# Altium schematic sheet Main Board RGB.SchDoc
size B
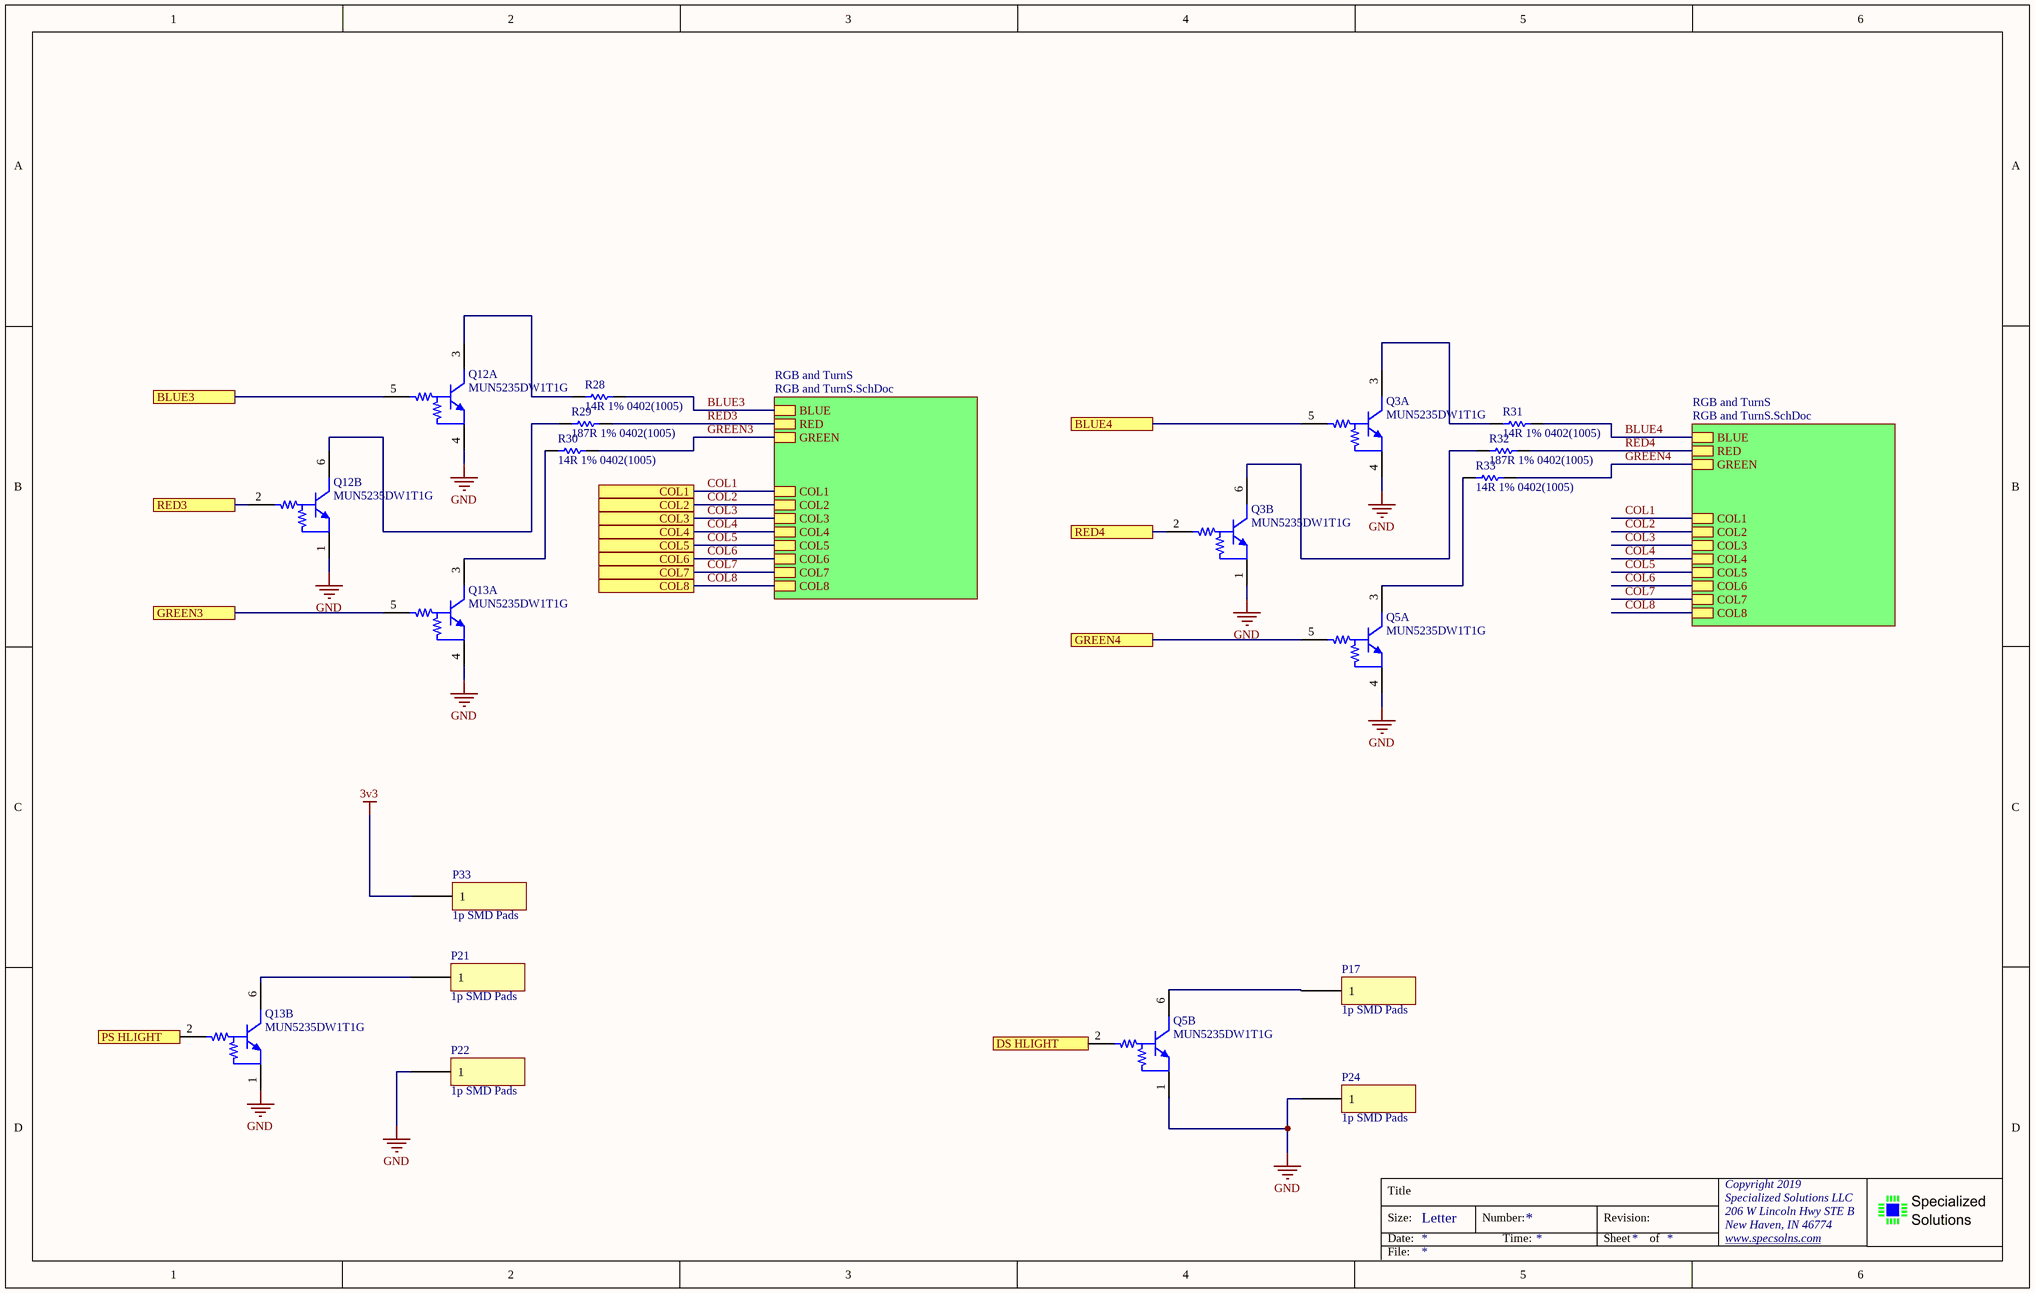
[diagram p0: Main Board RGB.SchDoc]

## Parts
P17  1p SMD Pads  [1p SMD pad]
P21  1p SMD Pads  [1p SMD pad]
P22  1p SMD Pads  [1p SMD pad]
P24  1p SMD Pads  [1p SMD pad]
P33  1p SMD Pads  [1p SMD pad]
Q3  MUN5235DW1T1G  [ONSC-SOT-363-6-419B-02_V]  (parts A,B of 2)
Q5  MUN5235DW1T1G  [ONSC-SOT-363-6-419B-02_V]  (parts A,B of 2)
Q12  MUN5235DW1T1G  [ONSC-SOT-363-6-419B-02_V]  (parts A,B of 2)
Q13  MUN5235DW1T1G  [ONSC-SOT-363-6-419B-02_V]  (parts A,B of 2)
R28  14R 1% 0402(1005)  [RESC0402(1005)_N]
R29  187R 1% 0402(1005)  [RESC0402(1005)_N]
R30  14R 1% 0402(1005)  [RESC0402(1005)_N]
R31  14R 1% 0402(1005)  [RESC0402(1005)_N]
R32  187R 1% 0402(1005)  [RESC0402(1005)_N]
R33  14R 1% 0402(1005)  [RESC0402(1005)_N]

## Sub-sheets
RGB and TurnS = RGB and TurnS.SchDoc: BLUE, RED, GREEN, COL7, COL5, COL3, COL1, COL2, COL4, COL6, COL8
RGB and TurnS = RGB and TurnS.SchDoc: BLUE, RED, GREEN, COL7, COL5, COL3, COL1, COL2, COL4, COL6, COL8

## Ports
BLUE3, BLUE4, COL1, COL2, COL3, COL4, COL5, COL6, COL7, COL8, DS HLIGHT, GREEN3, GREEN4, PS HLIGHT, RED3, RED4

## Nets
3v3: P33.1
GND: P22.1 P24.1 Q3.1(E) Q3.4(E) Q5.1(E) Q5.4(E) Q12.1(E) Q12.4(E) Q13.1(E) Q13.4(E)
BLUE3: R28.2 ; sheet RGB and TurnS/BLUE
BLUE3: Q12.5(B) ; port BLUE3  [a separate net that carries the same name]
BLUE4: R31.2 ; sheet RGB and TurnS/BLUE
BLUE4: Q3.5(B) ; port BLUE4  [a separate net that carries the same name]
COL1: port COL1, sheet RGB and TurnS/COL1, sheet RGB and TurnS/COL1
COL2: port COL2, sheet RGB and TurnS/COL2, sheet RGB and TurnS/COL2
COL3: port COL3, sheet RGB and TurnS/COL3, sheet RGB and TurnS/COL3
COL4: port COL4, sheet RGB and TurnS/COL4, sheet RGB and TurnS/COL4
COL5: port COL5, sheet RGB and TurnS/COL5, sheet RGB and TurnS/COL5
COL6: port COL6, sheet RGB and TurnS/COL6, sheet RGB and TurnS/COL6
COL7: port COL7, sheet RGB and TurnS/COL7, sheet RGB and TurnS/COL7
COL8: port COL8, sheet RGB and TurnS/COL8, sheet RGB and TurnS/COL8
DS HLIGHT: Q5.2(B) ; port DS HLIGHT
GREEN3: R30.2 ; sheet RGB and TurnS/GREEN
GREEN3: Q13.5(B) ; port GREEN3  [a separate net that carries the same name]
GREEN4: R33.2 ; sheet RGB and TurnS/GREEN
GREEN4: Q5.5(B) ; port GREEN4  [a separate net that carries the same name]
PS HLIGHT: Q13.2(B) ; port PS HLIGHT
RED3: R29.2 ; sheet RGB and TurnS/RED
RED3: Q12.2(B) ; port RED3  [a separate net that carries the same name]
RED4: R32.2 ; sheet RGB and TurnS/RED
RED4: Q3.2(B) ; port RED4  [a separate net that carries the same name]
NetP17_1: P17.1 Q5.6(C)
NetP21_1: P21.1 Q13.6(C)
NetQ3_3: Q3.3(C) R31.1
NetQ3_6: Q3.6(C) R32.1
NetQ5_3: Q5.3(C) R33.1
NetQ12_3: Q12.3(C) R28.1
NetQ12_6: Q12.6(C) R29.1
NetQ13_3: Q13.3(C) R30.1

## Notes on the sheet
- Title
- Size:
- Date:
- Letter
- Number:
- Time:
- Revision:
- Sheet
- of
- Copyright 2019
- Specialized Solutions LLC
- 206 W Lincoln Hwy STE B
- New Haven, IN 46774
- www.specsolns.com <http://www.specsolns.com>
- File:

## Library data of the parts
P17 P21 P22 P24 P33 = 1p SMD
Q3 Q5 Q12 Q13 = CMP-0630-00303-1: Dual NPN Bias Resistor Transistors, R1=2.2 kOhm, R2=47 kOhm, NPN Transistors, 6-Pin SOT-363, Pb-Free, Tape and Reel; Manufacturer: On Semiconductor; V(BR)CEO Min (V): 50; hFE Min: 80; IC Continuous (A): 0.1; R1/R2 Typ: 0.047; Packing: Tape and Reel; ComponentLink1URL: http://www.onsemi.com/; Mounting Technology: Surface Mount; ComponentLink1Description: Manufacturer URL; ComponentLink3Description: Package Specification; PackageVersion: Rev. Y, 12/2012; RoHS: TRUE; PackageDescription: 6-Pin Small Outline Transistor, Body 2 x 1.25 mm, Pitch 0.65 mm; PackageReference: SOT-363-6-419B-02; ComponentLink3URL: http://www.onsemi.cn/pub_link/Collateral/419B-02.PDF; DatasheetVersion: Rev. 0; ComponentLink2URL: http://www.onsemi.cn/pub_link/Collateral/DTC123JD-D.PDF; PartNumber: MUN5235DW1T1G; Polarity: Dual NPN; ComponentLink2Description: Datasheet; PartId: 1
R28 R30 R31 R33 = CMP-1011-00299-1: 14R 0.063W 1% 0402 (1005 Metric)  SMD; Value: 14.00 Ohm; Case-EIA: 0402; Case-Metric: 1005; Technology: SMT; Tolerance: 1 %; Power: 0.063 W
R29 R32 = CMP-1011-00426-1: 187R 0.063W 1% 0402 (1005 Metric)  SMD; Case-EIA: 0402; Value: 187.00 Ohm; Case-Metric: 1005; Technology: SMT; Tolerance: 1 %; Power: 0.063 W